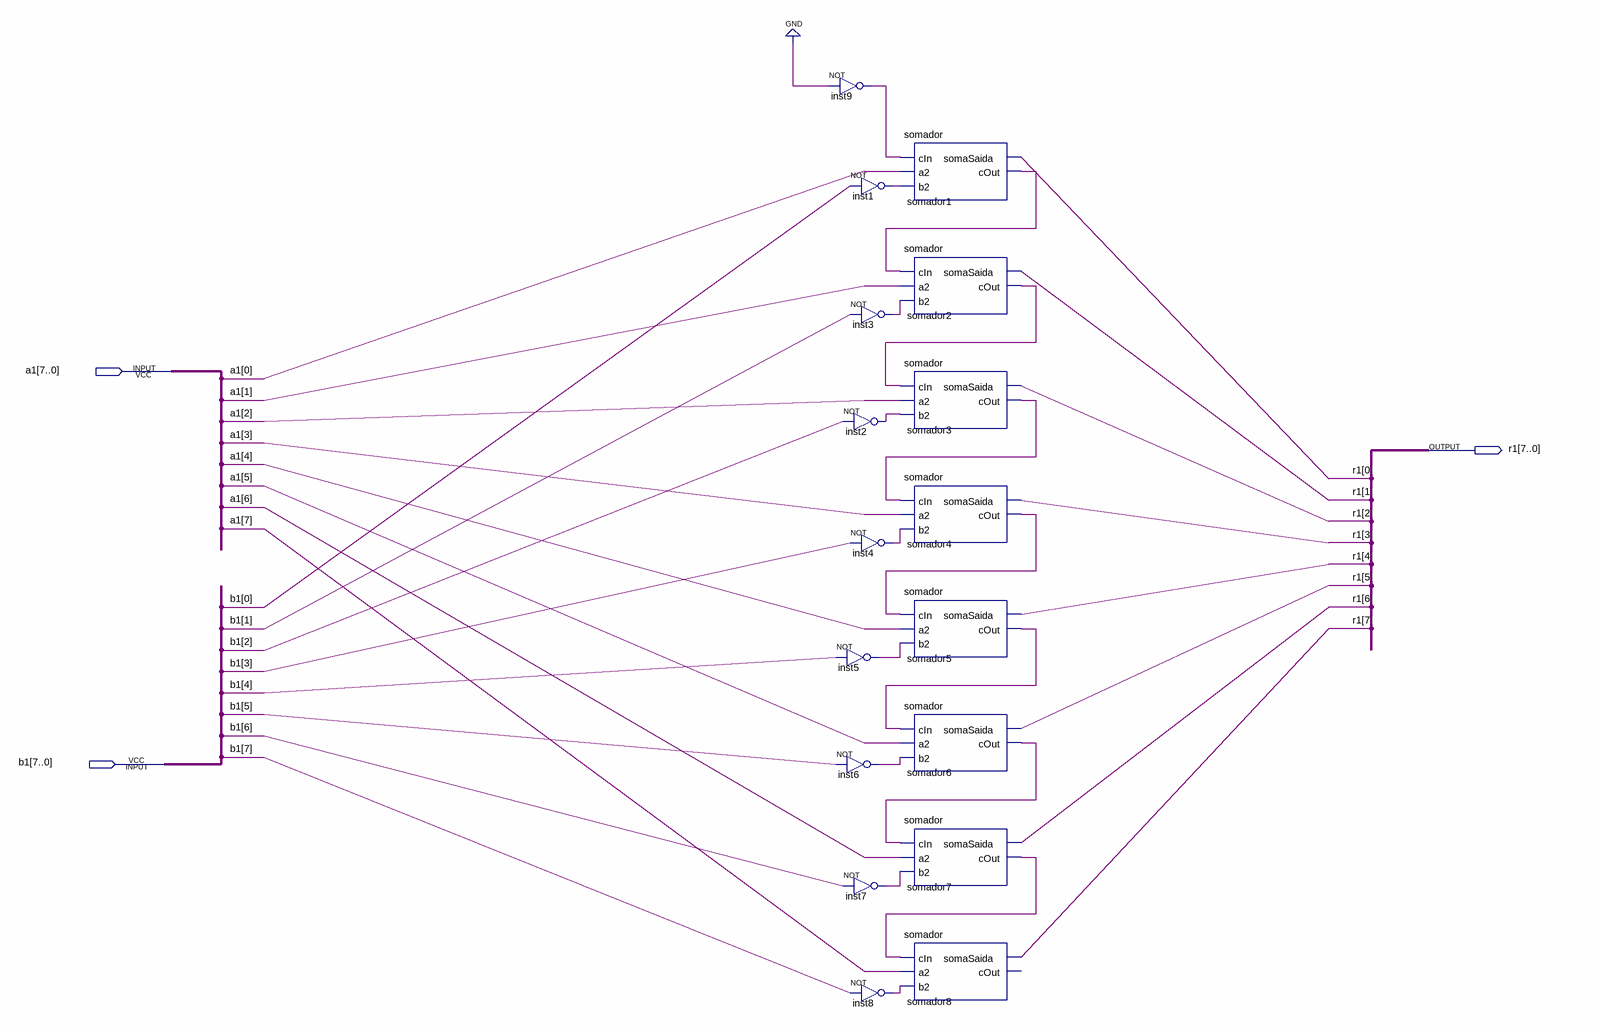
[diagram p0: schematic sheet]
// Quartus schematic subtrador.bdf as structural Verilog: 17 symbols, 3 pins
module subtrador (
  input  [7:0] a1,
  input  [7:0] b1,
  output [7:0] r1
);

  wire inst1_out, inst2_out, inst3_out, inst4_out, inst5_out, inst6_out, inst7_out, inst8_out, inst9_out,
       somador1_cout, somador2_cout, somador3_cout, somador4_cout, somador5_cout, somador6_cout,
       somador7_cout;

  not inst9 (inst9_out, 1'b0);
  not inst1 (inst1_out, b1[0]);
  not inst3 (inst3_out, b1[1]);
  not inst2 (inst2_out, b1[2]);
  not inst4 (inst4_out, b1[3]);
  not inst5 (inst5_out, b1[4]);
  not inst6 (inst6_out, b1[5]);
  not inst7 (inst7_out, b1[6]);
  not inst8 (inst8_out, b1[7]);
  somador somador1 (.cIn(inst9_out), .a2(a1[0]), .b2(inst1_out), .somaSaida(r1[0]), .cOut(somador1_cout));
  somador somador2 (.cIn(somador1_cout), .a2(a1[1]), .b2(inst3_out), .somaSaida(r1[1]), .cOut(somador2_cout));
  somador somador3 (.cIn(somador2_cout), .a2(a1[2]), .b2(inst2_out), .somaSaida(r1[2]), .cOut(somador3_cout));
  somador somador4 (.cIn(somador3_cout), .a2(a1[3]), .b2(inst4_out), .somaSaida(r1[3]), .cOut(somador4_cout));
  somador somador5 (.cIn(somador4_cout), .a2(a1[4]), .b2(inst5_out), .somaSaida(r1[4]), .cOut(somador5_cout));
  somador somador6 (.cIn(somador5_cout), .a2(a1[5]), .b2(inst6_out), .somaSaida(r1[5]), .cOut(somador6_cout));
  somador somador7 (.cIn(somador6_cout), .a2(a1[6]), .b2(inst7_out), .somaSaida(r1[6]), .cOut(somador7_cout));
  somador somador8 (.cIn(somador7_cout), .a2(a1[7]), .b2(inst8_out), .somaSaida(r1[7]));  // open: cOut
endmodule
